# Altium schematic sheet Photodiode.SchDoc
size 420 x 297 mm; Address1: Address1; Address2: Address2; Address3: Address3; Address4: Address4; DocumentNumber: *Э3; SheetNumber: 2; SheetTotal: 11; DocumentType: Схема электрическая *
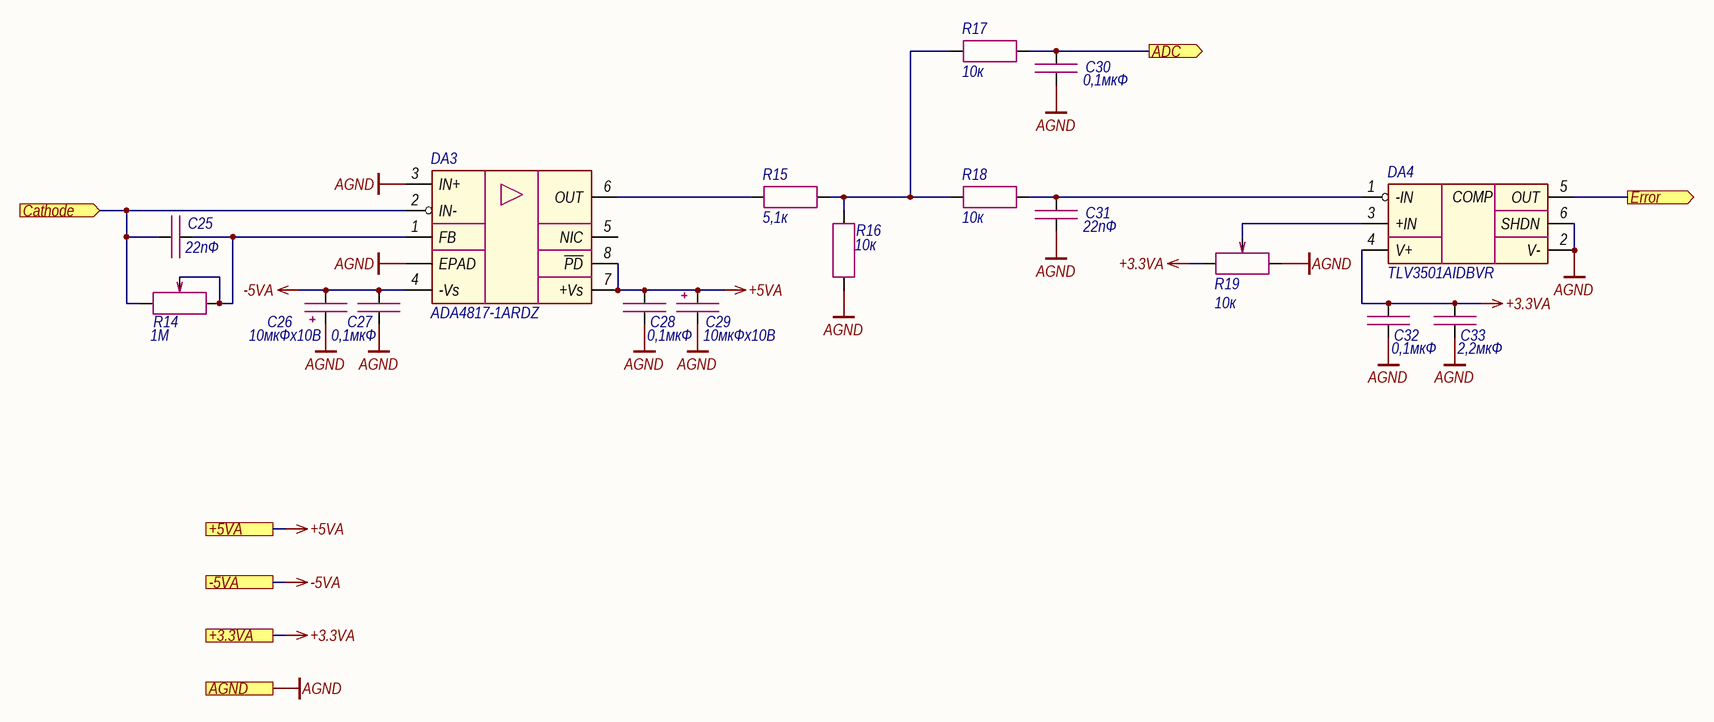
[diagram p0: Photodiode.SchDoc]

## Parts
C25  22пФ  [CAP_0603]
C26  10мкФх10B  [CAP_A]
C27  0,1мкФ  [CAP_0603]
C28  0,1мкФ  [CAP_0603]
C29  10мкФх10B  [CAP_A]
C30  0,1мкФ  [CAP_0603]
C31  22пФ  [CAP_0603]
C32  0,1мкФ  [CAP_0603]
C33  2,2мкФ  [CAP_0603]
DA3  ADA4817-1ARDZ  [SOIC-8 EPAD]
DA4  TLV3501AIDBVR  [SOT-23-6]
R14  1М  [3224W]
R15  5,1к  [RES_0603]
R16  10к  [RES_0603]
R17  10к  [RES_0603]
R18  10к  [RES_0603]
R19  10к  [3224W]

## Ports
+3.3VA (see Main[2A], Hardwiring[4D], LD_driver[1D], Thermistor[2C]), +5VA (see Main[1A], LD_driver[1D]), -5VA (see Main[1A]), ADC (out, see Main[2A]), AGND (see Main[1A], Hardwiring[4D], LD_driver[1D], Thermistor[2C]), Cathode (in, see Main[1A]), Error (out, see Main[2A])

## Nets
+3.3VA: C32.1 C33.1 DA4.4(V+) R19.3 ; port +3.3VA
+5VA: C28.1 C29.1 DA3.7(+Vs) DA3.8(~{PD}) ; port +5VA
-5VA: C26.2 C27.1 DA3.4(-Vs) ; port -5VA
AGND: C26.1 C27.2 C28.2 C29.2 C30.2 C31.2 C32.2 C33.2 DA3.3(IN+) DA3.EPAD DA4.2(V-) DA4.6(SHDN) R16.2 R19.1 ; port AGND
ADC: C30.1 R17.2 ; port ADC
Cathode: C25.2 DA3.2(IN-) R14.1 ; port Cathode
Error: DA4.5(OUT) ; port Error
NetC25_1: C25.1 DA3.1(FB) R14.2 R14.3
NetC31_1: C31.1 DA4.1(-IN) R18.2
NetDA3_6: DA3.6(OUT) R15.1
NetDA4_3: DA4.3(+IN) R19.2
NetR15_2: R15.2 R16.1 R17.1 R18.1

Not connected (* = marked no-connect by the designer): DA3 5(NIC)

## Notes on the sheet
- Подп. и дата
- Инв. № дубл.
- Взам. инв. №
- Инв. № подл.
- Изм.
- Лист
- № докум.
- Подп.
- Дата
- Копировал
- Формат А3
- (in symbol TLV3501) COMP

## Library data of the parts
C25 C31 = Capacitor: Manufacturer: Murata; Model: GRM1885C1H220JA01D; Value: 22пФ; Document: *
C26 C29 = Capacitor_Polar: Model: TECAP, 10 мкФ, 10 В, тип A, 10%; Value: 10мкФх10B; Document: *; Manufacturer: *
C27 C28 C30 C32 = Capacitor: Manufacturer: Murata; Model: GRM188R71H104KA93D; Value: 0,1мкФ; Document: *
C33 = Capacitor: Manufacturer: Murata; Model: GRM188R61H225KE11D; Value: 2,2мкФ; Document: *
DA3 = ADA4817-1ARDZ: Manufacturer: Analog Devices; Model: ADA4817-1ARDZ; Document: *
DA4 = TLV3501: Manufacturer: Texas Instruments; Model: TLV3501AIDBVR; Document: *
R14 = Resistor_Variable: Manufacturer: Bourns; Model: 3224W-1-105; Value: 1М; Document: *
R15 = Resistor: Manufacturer: Yageo; Model: RC0603FR-075K1L; Value: 5,1к; Document: *
R16-R18 = Resistor: Manufacturer: Yageo; Model: RC0603FR-0710KL; Value: 10к; Document: *
R19 = Resistor_Variable: Manufacturer: Bourns; Model: 3224W-1-103; Value: 10к; Document: *